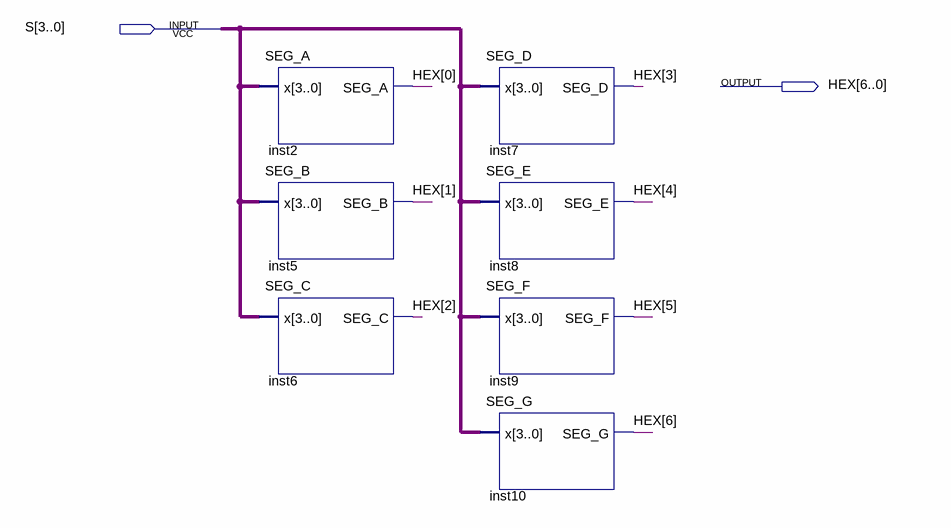
[diagram p0: schematic sheet]
// Quartus schematic 7SEGDECODERBAR.bdf as structural Verilog: 7 symbols, 2 pins
module \7SEGDECODERBAR  (
  input  [3:0] S,
  output [6:0] HEX
);

  SEG_A inst2 (.x(S), .SEG_A(HEX[0]));
  SEG_B inst5 (.x(S), .SEG_B(HEX[1]));
  SEG_C inst6 (.x(S), .SEG_C(HEX[2]));
  SEG_D inst7 (.x(S), .SEG_D(HEX[3]));
  SEG_E inst8 (.x(S), .SEG_E(HEX[4]));
  SEG_F inst9 (.x(S), .SEG_F(HEX[5]));
  SEG_G inst10 (.x(S), .SEG_G(HEX[6]));
endmodule
